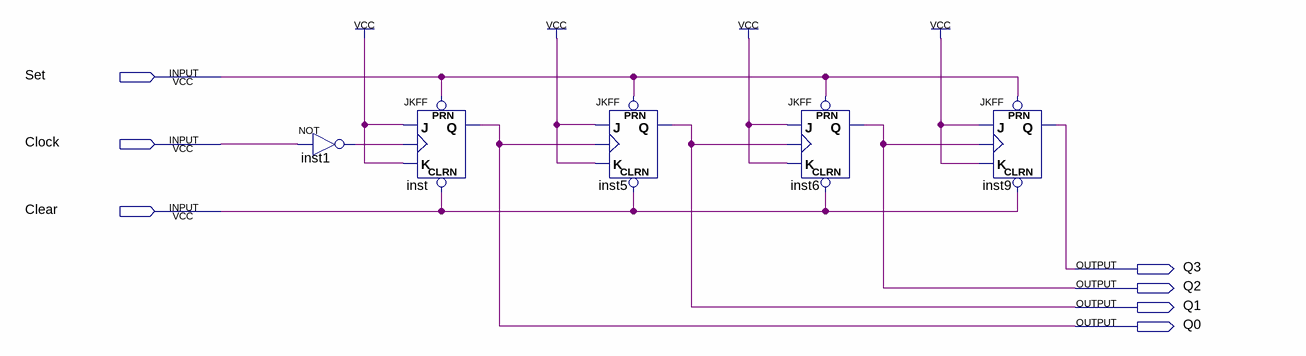
[diagram p0: schematic sheet]
// Quartus schematic Counter2.bdf as structural Verilog: 5 symbols, 7 pins
module Counter2 (
  input  Set,
  input  Clock,
  input  Clear,
  output Q3,
  output Q2,
  output Q1,
  output Q0
);

  wire inst1_out;

  not inst1 (inst1_out, Clock);
  JKFF inst (.PRN(Set), .CLRN(Clear), .K(1'b1), .J(1'b1), .CLK(inst1_out), .Q(Q0));
  JKFF inst5 (.PRN(Set), .CLRN(Clear), .K(1'b1), .J(1'b1), .CLK(Q0), .Q(Q1));
  JKFF inst6 (.PRN(Set), .CLRN(Clear), .K(1'b1), .J(1'b1), .CLK(Q1), .Q(Q2));
  JKFF inst9 (.PRN(Set), .CLRN(Clear), .K(1'b1), .J(1'b1), .CLK(Q2), .Q(Q3));
endmodule
